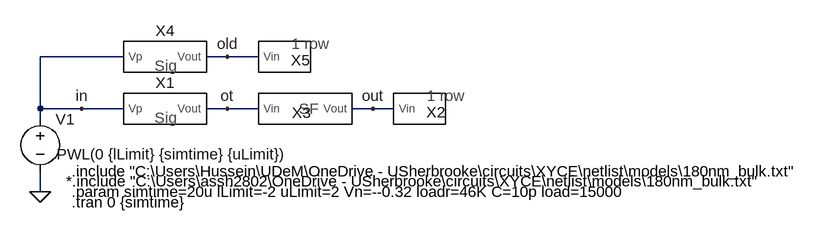
[diagram p0: schematic Test_RNN_Sigmoid3_HA_generated.asc]
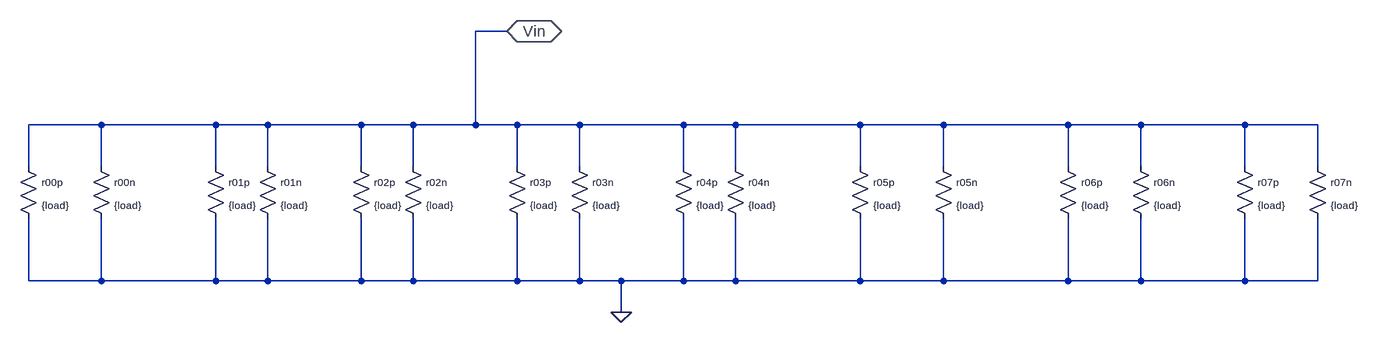
[diagram p1: sub-circuit crossbar.asc]
Test_RNN_Sigmoid3_HA_generated.asc, the LTspice schematic file:
Version 4
SHEET 1 1164 680
WIRE 112 96 -16 96
WIRE 272 96 240 96
WIRE 320 96 272 96
WIRE -16 176 -16 96
WIRE 48 176 -16 176
WIRE 112 176 48 176
WIRE 272 176 240 176
WIRE 320 176 272 176
WIRE 496 176 464 176
WIRE 528 176 496 176
WIRE -16 192 -16 176
WIRE -16 304 -16 272
FLAG -16 304 0
FLAG 272 176 ot
FLAG 48 176 in
FLAG 496 176 out
FLAG 272 96 old
SYMBOL RNN_Sigmoid3_HA 176 176 R0
SYMATTR InstName X1
SYMBOL voltage -16 176 R0
WINDOW 3 25 70 Left 0
WINDOW 123 0 0 Left 0
WINDOW 39 0 0 Left 0
SYMATTR Value PWL(0 {lLimit} {simtime} {uLimit})
SYMATTR InstName V1
SYMBOL crossbar 560 176 R0
SYMATTR InstName X2
SYMBOL sourceFollower 384 176 R0
SYMATTR InstName X3
SYMBOL RNN_Sigmoid3_HA 176 96 R0
SYMATTR InstName X4
SYMBOL crossbar 352 96 R0
SYMATTR InstName X5
TEXT 32 304 Left 0 !.param simtime=20u lLimit=-2 uLimit=2 Vn=--0.32 loadr=46K C=10p load=15000
TEXT 32 320 Left 0 !.tran 0 {simtime}
TEXT 24 288 Left 0 !*.include "C:\\Users\\assh2802\\OneDrive - USherbrooke\\circuits\\XYCE\\netlist\\models\\180nm_bulk.txt"
TEXT 32 272 Left 0 !.include "C:\\Users\\Hussein\\UDeM\\OneDrive - USherbrooke\\circuits\\XYCE\\netlist\\models\\180nm_bulk.txt"

crossbar.asc, the sub-circuit schematic file:
Version 4
SHEET 1 2172 680
WIRE 848 -96 800 -96
WIRE 224 48 112 48
WIRE 400 48 224 48
WIRE 480 48 400 48
WIRE 624 48 480 48
WIRE 704 48 624 48
WIRE 800 48 800 -96
WIRE 800 48 704 48
WIRE 864 48 800 48
WIRE 960 48 864 48
WIRE 1120 48 960 48
WIRE 1200 48 1120 48
WIRE 1392 48 1200 48
WIRE 1520 48 1392 48
WIRE 1712 48 1520 48
WIRE 1824 48 1712 48
WIRE 1984 48 1824 48
WIRE 2096 48 1984 48
WIRE 112 112 112 48
WIRE 224 112 224 48
WIRE 400 112 400 48
WIRE 480 112 480 48
WIRE 624 112 624 48
WIRE 704 112 704 48
WIRE 864 112 864 48
WIRE 960 112 960 48
WIRE 1120 112 1120 48
WIRE 1200 112 1200 48
WIRE 1392 112 1392 48
WIRE 1520 112 1520 48
WIRE 1712 112 1712 48
WIRE 1824 112 1824 48
WIRE 1984 112 1984 48
WIRE 2096 112 2096 48
WIRE 112 288 112 192
WIRE 224 288 224 192
WIRE 224 288 112 288
WIRE 400 288 400 192
WIRE 400 288 224 288
WIRE 480 288 480 192
WIRE 480 288 400 288
WIRE 624 288 624 192
WIRE 624 288 480 288
WIRE 704 288 704 192
WIRE 704 288 624 288
WIRE 864 288 864 192
WIRE 864 288 704 288
WIRE 960 288 960 192
WIRE 960 288 864 288
WIRE 1024 288 960 288
WIRE 1120 288 1120 192
WIRE 1120 288 1024 288
WIRE 1200 288 1200 192
WIRE 1200 288 1120 288
WIRE 1392 288 1392 192
WIRE 1392 288 1200 288
WIRE 1520 288 1520 192
WIRE 1520 288 1392 288
WIRE 1712 288 1712 192
WIRE 1712 288 1520 288
WIRE 1824 288 1824 192
WIRE 1824 288 1712 288
WIRE 1984 288 1984 192
WIRE 1984 288 1824 288
WIRE 2096 288 2096 192
WIRE 2096 288 1984 288
WIRE 1024 336 1024 288
FLAG 1024 336 0
FLAG 848 -96 Vin
IOPIN 848 -96 BiDir
SYMBOL res 96 96 R0
WINDOW 0 36 40 Left 1
WINDOW 3 36 76 Left 1
SYMATTR InstName r00p
SYMATTR Value {load}
SYMBOL res 208 96 R0
WINDOW 0 36 40 Left 1
WINDOW 3 36 76 Left 1
SYMATTR InstName r00n
SYMATTR Value {load}
SYMBOL res 384 96 R0
WINDOW 0 36 40 Left 1
WINDOW 3 36 76 Left 1
SYMATTR InstName r01p
SYMATTR Value {load}
SYMBOL res 464 96 R0
WINDOW 0 36 40 Left 1
WINDOW 3 36 76 Left 1
SYMATTR InstName r01n
SYMATTR Value {load}
SYMBOL res 608 96 R0
WINDOW 0 36 40 Left 1
WINDOW 3 36 76 Left 1
SYMATTR InstName r02p
SYMATTR Value {load}
SYMBOL res 688 96 R0
WINDOW 0 36 40 Left 1
WINDOW 3 36 76 Left 1
SYMATTR InstName r02n
SYMATTR Value {load}
SYMBOL res 848 96 R0
WINDOW 0 36 40 Left 1
WINDOW 3 36 76 Left 1
SYMATTR InstName r03p
SYMATTR Value {load}
SYMBOL res 944 96 R0
WINDOW 0 36 40 Left 1
WINDOW 3 36 76 Left 1
SYMATTR InstName r03n
SYMATTR Value {load}
SYMBOL res 1104 96 R0
WINDOW 0 36 40 Left 1
WINDOW 3 36 76 Left 1
SYMATTR InstName r04p
SYMATTR Value {load}
SYMBOL res 1184 96 R0
WINDOW 0 36 40 Left 1
WINDOW 3 36 76 Left 1
SYMATTR InstName r04n
SYMATTR Value {load}
SYMBOL res 1376 96 R0
WINDOW 0 36 40 Left 1
WINDOW 3 36 76 Left 1
SYMATTR InstName r05p
SYMATTR Value {load}
SYMBOL res 1504 96 R0
WINDOW 0 36 40 Left 1
WINDOW 3 36 76 Left 1
SYMATTR InstName r05n
SYMATTR Value {load}
SYMBOL res 1696 96 R0
WINDOW 0 36 40 Left 1
WINDOW 3 36 76 Left 1
SYMATTR InstName r06p
SYMATTR Value {load}
SYMBOL res 1808 96 R0
WINDOW 0 36 40 Left 1
WINDOW 3 36 76 Left 1
SYMATTR InstName r06n
SYMATTR Value {load}
SYMBOL res 1968 96 R0
WINDOW 0 36 40 Left 1
WINDOW 3 36 76 Left 1
SYMATTR InstName r07p
SYMATTR Value {load}
SYMBOL res 2080 96 R0
WINDOW 0 36 40 Left 1
WINDOW 3 36 76 Left 1
SYMATTR InstName r07n
SYMATTR Value {load}

The netlist it stands for:
* Test_RNN_Sigmoid3_HA_generated.asc
XX1 in ot RNN_Sigmoid3_HA  ; pins Vp Vout
V1 in 0 PWL(0 {lLimit} {simtime} {uLimit})
XX2 out crossbar
XX3 ot out sourceFollower  ; pins Vin Vout
XX4 in old RNN_Sigmoid3_HA  ; pins Vp Vout
XX5 old crossbar

* block symbol definitions
.subckt crossbar Vin
r00p Vin 0 {load}
r00n Vin 0 {load}
r01p Vin 0 {load}
r01n Vin 0 {load}
r02p Vin 0 {load}
r02n Vin 0 {load}
r03p Vin 0 {load}
r03n Vin 0 {load}
r04p Vin 0 {load}
r04n Vin 0 {load}
r05p Vin 0 {load}
r05n Vin 0 {load}
r06p Vin 0 {load}
r06n Vin 0 {load}
r07p Vin 0 {load}
r07n Vin 0 {load}
.ends crossbar

.param simtime=20u lLimit=-2 uLimit=2 Vn=--0.32 loadr=46K C=10p load=15000
.tran 0 {simtime}
*.include "C:\Users\assh2802\OneDrive - USherbrooke\circuits\XYCE\netlist\models\180nm_bulk.txt"
.include "C:\Users\Hussein\UDeM\OneDrive - USherbrooke\circuits\XYCE\netlist\models\180nm_bulk.txt"
.backanno
.end